# EAGLE design SparkFun_Ultrasonic_Sensor (EAGLE 9.6.2)
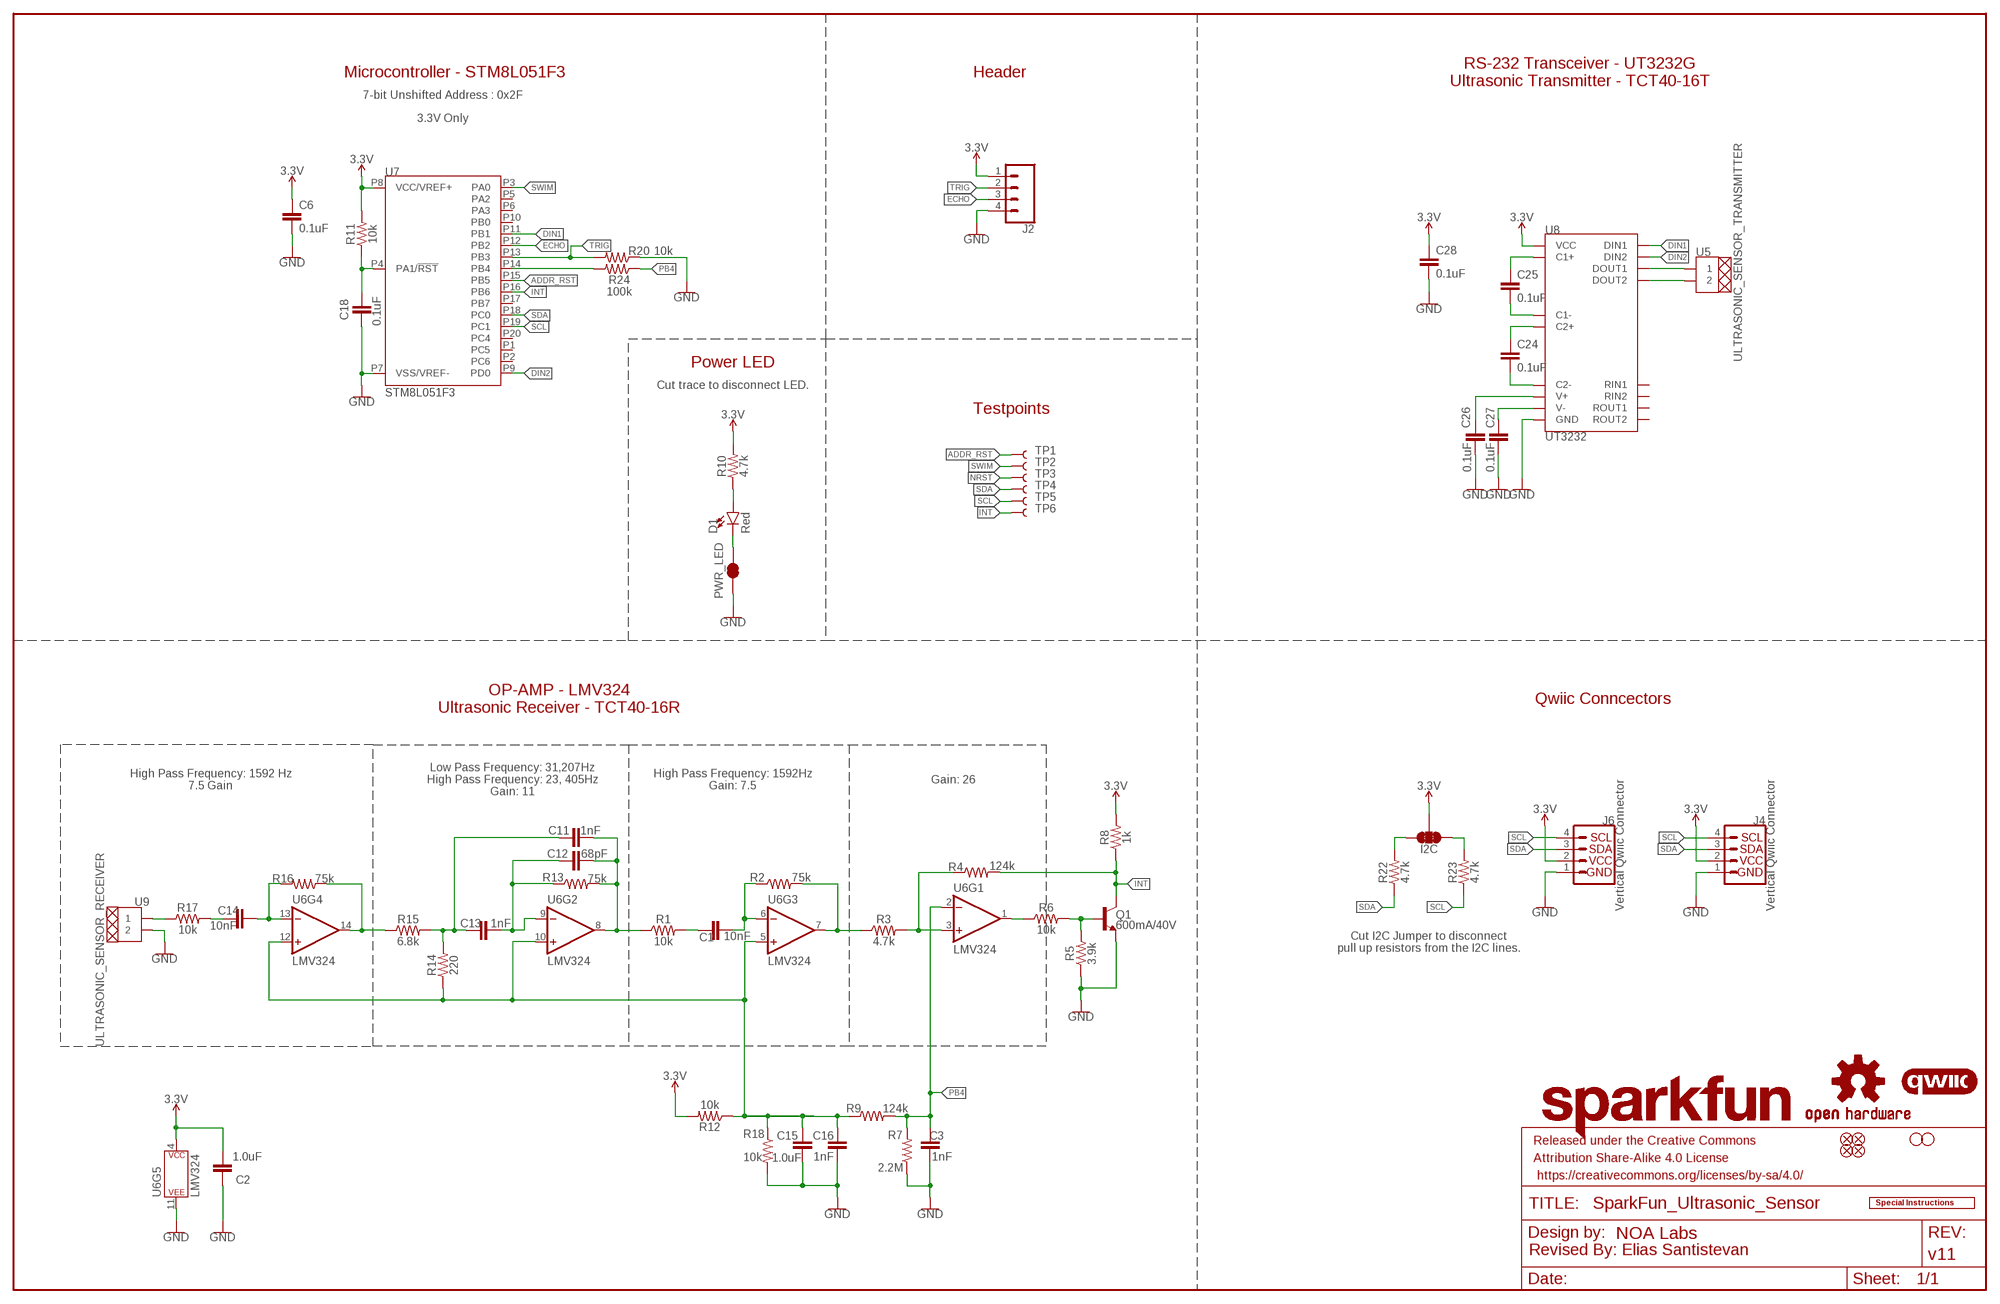
[diagram p0: schematic, sheet 1]

## Parts
C1  10nF  10NF-0603-50V-10%  [0603]
C2  1.0uF  1.0UF-0603-16V-10%  [0603]
C3  1nF  1.0NF/1000PF-0603-50V-10%  [0603]
C6  0.1uF  0.1UF-0603-25V-(+80/-20%)  [0603]
C11  1nF  1.0NF/1000PF-0603-50V-10%  [0603]
C12  68pF  68PF-0603-50V-5%  [0603]
C13  1nF  1.0NF/1000PF-0603-50V-10%  [0603]
C14  10nF  10NF-0603-50V-10%  [0603]
C15  1.0uF  1.0UF-0603-16V-10%  [0603]
C16  1nF  1.0NF/1000PF-0603-50V-10%  [0603]
C18  0.1uF  0.1UF-0603-25V-(+80/-20%)  [0603]
C24  0.1uF  0.1UF-0603-25V-(+80/-20%)  [0603]
C25  0.1uF  0.1UF-0603-25V-(+80/-20%)  [0603]
C26  0.1uF  0.1UF-0603-25V-(+80/-20%)  [0603]
C27  0.1uF  0.1UF-0603-25V-(+80/-20%)  [0603]
C28  0.1uF  0.1UF-0603-25V-(+80/-20%)  [0603]
D1  Red  LED-RED_0603-KB  [LED-0603]
FD1  FIDUCIAL1X2  [FIDUCIAL-1X2]
FD2  FIDUCIAL1X2  [FIDUCIAL-1X2]
FD3  FIDUCIAL1X2  [FIDUCIAL-1X2]
FD4  FIDUCIAL1X2  [FIDUCIAL-1X2]
FRAME1  FRAME-LEDGER  [CREATIVE_COMMONS]
H1  STAND-OFFTIGHT  [STAND-OFF-TIGHT]
H2  STAND-OFFTIGHT  [STAND-OFF-TIGHT]
I2C  JUMPER-SMT_3_2-NC_TRACE_SILK  [SMT-JUMPER_3_2-NC_TRACE_SILK]
J2  CONN_041X04_NO_SILK_NO_POP  [1X04_NO_SILK]
J4  Vertical Qwiic Connector  QWIIC_CONNECTOR  [JST04_1MM_VERT]
J6  Vertical Qwiic Connector  QWIIC_CONNECTOR  [JST04_1MM_VERT]
LOGO1  SPECIAL_INSTRUCTIONS-ORDERING  [ORDERING_INSTRUCTIONS]
LOGO2  SFE_LOGO_NAME.1_INCH  [SFE_LOGO_NAME_.1]
LOGO3  QWIIC_LOGO_3MM  [QWIIC_3MM]
LOGO4  OSHW-LOGOS  [OSHW-LOGO-S]
PWR_LED  JUMPER-SMT_2_NC_TRACE_SILK  [SMT-JUMPER_2_NC_TRACE_SILK]
Q1  600mA/40V  TRANS_NPN-MMBT2222AL  [SOT23-3]
R1  10k  10KOHM-0603-1/10W-1%  [0603]
R2  75k  75KOHM-0603-1/10W-1%  [0603]
R3  4.7k  4.7KOHM-0603-1/10W-1%  [0603]
R4  124k  124KOHM  [0603]
R5  3.9k  3.9KOHM-0603-1/10W-1%  [0603]
R6  10k  10KOHM-0603-1/10W-1%  [0603]
R7  2.2M  2.2MOHMS-0603-1/10W-1%  [0603]
R8  1k  1KOHM-0603-1/10W-1%  [0603]
R9  124k  124KOHM  [0603]
R10  4.7k  4.7KOHM-0603-1/10W-1%  [0603]
R11  10k  10KOHM-0603-1/10W-1%  [0603]
R12  10k  10KOHM-0603-1/10W-1%  [0603]
R13  75k  75KOHM-0603-1/10W-1%  [0603]
R14  220  220OHM-0603-1/10W-1%  [0603]
R15  6.8k  6.8KOHM-0603-1/10W-1%  [0603]
R16  75k  75KOHM-0603-1/10W-1%  [0603]
R17  10k  10KOHM-0603-1/10W-1%  [0603]
R18  10k  10KOHM-0603-1/10W-1%  [0603]
R20  10k  10KOHM-0603-1/10W-1%  [0603]
R22  4.7k  4.7KOHM-0603-1/10W-1%  [0603]
R23  4.7k  4.7KOHM-0603-1/10W-1%  [0603]
R24  100k  100KOHM-0603-1/10W-1%  [0603]
TP1  TEST-POINT3X5  [PAD.03X.05]
TP2  TEST-POINT3X5  [PAD.03X.05]
TP3  TEST-POINT3X5  [PAD.03X.05]
TP4  TEST-POINT3X5  [PAD.03X.05]
TP5  TEST-POINT3X5  [PAD.03X.05]
TP6  TEST-POINT3X5  [PAD.03X.05]
U5  ULTRASONIC_SENSOR_TRANSMITTER  [TFT40-16T]
U6  LMV324  [SO14]
U7  STM8L051F3  [TSSOP20]
U8  UT3232  [TSSOP16]
U9  ULTRASONIC_SENSOR_RECEIVER  [TCT40-16R]

## Nets
3.3V: C2.2 C6.1 C28.1 I2C.2 J2.1 J4.2 J6.2 R8.2 R10.2 R11.2 R12.2 U6.4(P$V+) U7.P8(VCC/VREF+) U8.P16(VCC)
ADDR_RST: TP1.1 U7.P15(PB5)
DIN1: U7.P11(PB1) U8.P11(DIN1)
DIN2: U7.P9(PD0) U8.P10(DIN2)
ECHO: J2.3 U7.P12(PB2)
GND: C2.1 C3.2 C6.2 C15.1 C16.1 C18.2 C26.2 C27.2 C28.2 J2.4 J4.1 J6.1 PWR_LED.1 Q1.2(E) R5.1 R7.1 R18.2 R20.1 U6.11(P$V-) U7.P7(VSS/VREF-) U8.P15(GND) U9.P2
INT: Q1.3(C) R4.2 R8.1 TP6.1 U7.P16(PB6)
N: R24.2 U7.P14(PB4)
N$1: R2.2 R3.1 U6.7(OUT)
N$2: C1.1 R2.1 U6.6(-IN)
N$3: C1.2 R1.2
N$4: R3.2 R4.1 U6.3(+IN)
N$5: Q1.1(B) R5.2 R6.2
N$6: R6.1 U6.1(OUT)
N$7: D1.A R10.1
N$8: C25.1 U8.P1(C1+)
N$9: C12.1 C13.1 R13.1 U6.9(-IN)
N$10: C11.2 C12.2 R1.1 R13.2 U6.8(OUT)
N$11: D1.C PWR_LED.2
N$12: C11.1 C13.2 R14.2 R15.2
N$14: R15.1 R16.1 U6.14(OUT)
N$15: C14.1 R16.2 U6.13(-IN)
N$16: C14.2 R17.2
N$19: I2C.3 R22.2
N$20: I2C.1 R23.2
N$26: R17.1 U9.P1
N$31: C15.2 C16.2 R9.1 R12.1 R14.1 R18.1 U6.5(+IN) U6.10(+IN) U6.12(+IN)
N$37: C25.2 U8.P3(C1-)
N$38: C24.1 U8.P4(C2+)
N$39: C24.2 U8.P5(C2-)
N$40: C27.1 U8.P6(V-)
N$41: C26.1 U8.P2(V+)
N$48: U5.P1 U8.P14(DOUT1)
N$49: U5.P2 U8.P7(DOUT2)
NRST: C18.1 R11.1 TP3.1 U7.P4(PA1/!RST!)
PB4: C3.1 R7.2 R9.2 R24.1 U6.2(-IN)
SCL: J4.4 J6.4 R23.1 TP5.1 U7.P19(PC1)
SDA: J4.3 J6.3 R22.1 TP4.1 U7.P18(PC0)
SWIM: TP2.1 U7.P3(PA0)
TRIG: J2.2 R20.2 U7.P13(PB3)
Unconnected: U7.P1(PC5) U7.P2(PC6) U7.P5(PA2) U7.P6(PA3) U7.P10(PB0) U7.P17(PB7) U7.P20(PC4) U8.P8(RIN2) U8.P9(ROUT2) U8.P12(ROUT1) U8.P13(RIN1)

## Notes on the sheet
- Microcontroller - STM8L051F3 | Header
- RS-232 Transceiver - UT3232G
  Ultrasonic Transmitter - TCT40-16T
- 7-bit Unshifted Address : 0x2F
- 3.3V Only
- Power LED
- Cut trace to disconnect LED.
- Testpoints
- OP-AMP - LMV324
  Ultrasonic Receiver - TCT40-16R
- Qwiic Conncectors
- High Pass Frequency: 1592 Hz
  7.5 Gain
- Low Pass Frequency: 31,207Hz
  High Pass Frequency: 23, 405Hz
  Gain: 11
- High Pass Frequency: 1592Hz
  Gain: 7.5
- Gain: 26
- Cut I2C Jumper to disconnect
  pull up resistors from the I2C lines.
- Revised By: Elias Santistevan

## Library data of the parts
C1 C14 = SparkFun-Capacitors:10NF: 0.01uF/10nF/10,000pF ceramic capacitors A capacitor is a passive two-terminal electrical component used to store electrical energy temporarily in an electric field. CAP-09321; PROD_ID: CAP-00867
C2 C15 = SparkFun-Capacitors:1.0UF: 1µF ceramic capacitors A capacitor is a passive two-terminal electrical component used to store electrical energy temporarily in an electric field.; PROD_ID: CAP-00868
C3 C11 C13 C16 = SparkFun-Capacitors:1.0NF/1000PF: 1nF/1,000pF ceramic capacitors A capacitor is a passive two-terminal electrical component used to store electrical energy temporarily in an electric field.; PROD_ID: CAP-07886
C6 C18 C24-C28 = SparkFun-Capacitors:0.1UF: 0.1µF ceramic capacitors A capacitor is a passive two-terminal electrical component used to store electrical energy temporarily in an electric field.; PROD_ID: CAP-00810
C12 = SparkFun-Capacitors:68PF: 68pF ceramic capacitors A capacitor is a passive two-terminal electrical component used to store electrical energy temporarily in an electric field.; PROD_ID: CAP-14092
D1 = SparkFun-LED:LED-RED: Red SMD LED Used in manufacturing of most products at SparkFun Packages: 0603 - KB - KingBright (DIO-17976) SMD 0603 package [Datasheet] <https://www.kingbrightusa.com/images/catalog/SPEC/APT1608SURCK.pdf> 0603 - (DIO-00819, has gone EOL) SMD 0603 package 0603 SMART - SMD 0603 SMART package ( more efficient and expensive)[Product Link] <http://www.osram-os.com/Graphics/XPic2/00077099_0.pdf> 1206 - SMD1206 package [Product Link] <https://www.sparkfun.com/datasheets/DevTools/LilyPad/Q150OVS4.pdff> SparkFun Products: Pro Mini 328 -5V <https://www.sparkfun.com/products/821> RedBoard <https://www.sparkfun.com/products/12757> IOIO-OTG <https://www.sparkfun.com/products/13613>; PROD_ID: DIO-17976
FD1-FD4 = SparkFun-Aesthetics:FIDUCIAL: Fiducial Alignment Points Point-of-reference for pick-and-place machines and other optical instruments.
FRAME1 = SparkFun-Aesthetics:FRAME-LEDGER: Schematic Frame - Ledger Standard 11x14 US Ledger frame; DESIGNER: NOA Labs; REV: v11
H1 H2 = SparkFun-Hardware:STAND-OFF: Stand Off Drill holes for mechanically mounting via screws, standoffs, etc. Note: Use the keepout ring to avoid running the screw head into surrounding components. Variant Overviews STAND-OFF - Mechanical footprint for a #4 phillips button head screw. STAND-OFF-TIGHT - Mechanical footprint for a #4 phillips button head screw, Example SparkFun Products Screw - Phillips Head (1/4", 4-40, 10 pack) <https://www.sparkfun.com/products/10453> (PRT-10453) Screw - Phillips Head (1/2", 4-40, 10 pack) <https://www.sparkfun.com/products/10452> (PRT-10452) Screw - Phillips Head (3/4", 4-40, 10 pack) <https://www.sparkfun.com/products/10451> (PRT-10451) Screw - Phillips Head (1", 4-40, 10 pack) <https://www.sparkfun.com/products/10450> (PRT-10450)
I2C = SparkFun-Jumpers:JUMPER-SMT_3_2-NC_TRACE: Normally closed trace jumper (2 of 2 connections) This jumper has a trace between all three pads so they are normally closed (NC). Use a razor knife to open the connection(s). For best results follow the IPC guidelines for cutting traces: Cutout at least 0.063 mm (0.005 in). Remove all loose material to clean up the cut area. Seal the cut with an approved epoxy. Reapply solder to reclose the connection(s).
J2 = SparkFun-Connectors:CONN_04: Multi connection point. Often used as Generic Header-pin footprint for 0.1 inch spaced/style header connections On any of the 0.1 inch spaced packages, you can populate with these: Break Away Headers - Straight <https://www.sparkfun.com/products/116> (PRT-00116) Break Away Male Headers - Right Angle <https://www.sparkfun.com/products/553> (PRT-00553) Female Headers <https://www.sparkfun.com/products/115> (PRT-00115) Break Away Headers - Machine Pin <https://www.sparkfun.com/products/117> (PRT-00117) Break Away Female Headers - Swiss Machine Pin <https://www.sparkfun.com/products/743> (PRT-00743) For SCREWTERMINALS and SPRING TERMINALS visit here: Screw Terimnals on SparkFun.com <https://www.sparkfun.com/search/results?term=Screw+Terminals> (5mm/3.5mm/2.54mm spacing) This device is also useful as a general connection point to wire up your design to another part of your project. Our various solder wires solder well into these plated through hole pads. Hook-Up Wire - Assortment (Stranded, 22 AWG) <https://www.sparkfun.com/products/11375> (PRT-11375) Hook-Up Wire - Assortment (Solid Core, 22 AWG) <https://www.sparkfun.com/products/11367> (PRT-11367) View the entire wire category on our website here <https://www.sparkfun.com/categories/141> Special notes: Molex polarized connector foot print use with SKU : PRT-08231 with associated crimp pins and housings. 1MM SMD Version SKU: PRT-10208
J4 J6 = SparkFun-Connectors:QWIIC_CONNECTOR: SparkFun I2C Standard Qwiic Connector An SMD 1mm pitch JST connector makes it easy and quick (get it? Qwiic?) to connect I2C devices to each other. The Qwiic system <http://www.sparkfun.com/qwiic> enables fast and solderless connection between popular platforms and various sensors and actuators. We carry 200mm <https://www.sparkfun.com/products/14204>, 100mm <https://www.sparkfun.com/products/14205>, 50mm <https://www.sparkfun.com/products/14206>, and breadboard friendly <https://www.sparkfun.com/products/14207> Qwiic cables. We also offer 10 pcs strips <https://www.sparkfun.com/products/14323> the SMD connectors.; PROD_ID: CONN-14483
LOGO1 = SparkFun-Aesthetics:SPECIAL_INSTRUCTIONS: Special Ordering/Production Instructions Alert Symbol for special PCB ordering instructions or unique production process warnings. Ordering Instructions Production Instructions Types of information that should be added to box: Copper weight Soldermask color Silk color PCB thickness Number of layers PCB Standard: 1.6mm FR4 1 oz copper immersion silver plating red soldermask white silkscreen Types of information that should be added to box: Special wash requirements Depaneling instructions Humidification Glue curing Default text settings: 0.07 inch 9% ratio 50% line distance
LOGO2 = SparkFun-Aesthetics:SFE_LOGO_NAME: SparkFun Font Logo This is the SparkFun name logo. The logo on the schematic will always be the same size; the package variant is the height of the flame part of the logo (or the height the flame would be, if it were drawn). Default layer for the logo on the board is tSilk.
LOGO3 = SparkFun-Aesthetics:QWIIC_LOGO: Qwiic Logos for placement on schematic and PCB. The 5.5mm silk logo is best for placing next to Qwiic connector.
LOGO4 = SparkFun-Aesthetics:OSHW-LOGO: Open-Source Hardware (OSHW) Logo This logo indicates the piece of hardware it is found on incorporates a OSHW license and/or adheres to the definition of open source hardware found here: http://freedomdefined.org/OSHW
PWR_LED = SparkFun-Jumpers:JUMPER-SMT_2_NC_TRACE: Normally closed trace jumper This jumper has a trace between two pads so it's normally closed (NC). Use a razor knife to open the connection. For best results follow the IPC guidelines for cutting traces: Cutout at least 0.063 mm (0.005 in). Remove all loose material to clean up the cut area. Seal the cut with an approved epoxy. Reapply solder to reclose the connection.
Q1 = SparkFun-DiscreteSemi:TRANS_NPN: NPN transistor Current controlled devices typically used to amplify current or used as a switch. BC547 - COM-08928 <http://www.sparkfun.com/products/8928> (TO-92 45V 100mA) (1.Collector 2.Base 3.Emitter) 2N3904 - COM-00521 <http://www.sparkfun.com/products/521> (TO-92 40V 200mA) (1.Emitter 2.Base 3.Collector) P2N2222A - COM-12852 <http://www.sparkfun.com/products/12852> (TO-92 40V 600mA) (1.Collector 2.Base 3.Emitter); PROD_ID: TRANS-08049
R1 R6 R11 R12 R17 R18 R20 = SparkFun-Resistors:10KOHM: 10kΩ resistor A resistor is a passive two-terminal electrical component that implements electrical resistance as a circuit element. Resistors act to reduce current flow, and, at the same time, act to lower voltage levels within circuits. - Wikipedia; PROD_ID: RES-00824
R2 R13 R16 = SparkFun-Resistors:75KOHM: 75kΩ resistor A resistor is a passive two-terminal electrical component that implements electrical resistance as a circuit element. Resistors act to reduce current flow, and, at the same time, act to lower voltage levels within circuits. - Wikipedia; PROD_ID: RES-09737
R3 R10 R22 R23 = SparkFun-Resistors:4.7KOHM: 4.7kΩ resistor A resistor is a passive two-terminal electrical component that implements electrical resistance as a circuit element. Resistors act to reduce current flow, and, at the same time, act to lower voltage levels within circuits. - Wikipedia; PROD_ID: RES-07857
R4 R9 = SparkFun-Resistors:124KOHM: 124kΩ resistor A resistor is a passive two-terminal electrical component that implements electrical resistance as a circuit element. Resistors act to reduce current flow, and, at the same time, act to lower voltage levels within circuits. - Wikipedia; PROD_ID: RES-14395
R5 = SparkFun-Resistors:3.9KOHM: 3.9kΩ resistor A resistor is a passive two-terminal electrical component that implements electrical resistance as a circuit element. Resistors act to reduce current flow, and, at the same time, act to lower voltage levels within circuits. - Wikipedia; PROD_ID: RES-08701
R7 = SparkFun-Resistors:2.2MOHMS: 2MΩ resistor A resistor is a passive two-terminal electrical component that implements electrical resistance as a circuit element. Resistors act to reduce current flow, and, at the same time, act to lower voltage levels within circuits. - Wikipedia; PROD_ID: RES-10054
R8 = SparkFun-Resistors:1KOHM: 1kΩ resistor A resistor is a passive two-terminal electrical component that implements electrical resistance as a circuit element. Resistors act to reduce current flow, and, at the same time, act to lower voltage levels within circuits. - Wikipedia; PROD_ID: RES-07856
R14 = SparkFun-Resistors:220OHM: 220Ω resistor A resistor is a passive two-terminal electrical component that implements electrical resistance as a circuit element. Resistors act to reduce current flow, and, at the same time, act to lower voltage levels within circuits. - Wikipedia; PROD_ID: RES-07861
R15 = SparkFun-Resistors:6.8KOHM: 6.8kΩ resistor A resistor is a passive two-terminal electrical component that implements electrical resistance as a circuit element. Resistors act to reduce current flow, and, at the same time, act to lower voltage levels within circuits. - Wikipedia; PROD_ID: RES-08597
R24 = SparkFun-Resistors:100KOHM: 100kΩ resistor A resistor is a passive two-terminal electrical component that implements electrical resistance as a circuit element. Resistors act to reduce current flow, and, at the same time, act to lower voltage levels within circuits. - Wikipedia; PROD_ID: RES-07828
TP1-TP6 = SparkFun-Connectors:TEST-POINT: SparkFun Test Points Bare copper test points for troubleshooting or In-Circuit-Testing. These are used by our Production team for verifying production board runs using pogo-pins on test beds. SparkFun Products: SparkFun LSM9DS1 Breakout <https://www.sparkfun.com/products/13284> SparkFun PSOC <https://www.sparkfun.com/products/13714> SparkFun Load Cell Amplifier <https://www.sparkfun.com/products/13879>
U5 = new_parts:ULTRASONIC_SENSOR: CU Devices - CUSA-R/T80 Ultrasonic Receivers and Transmitters; PROD_ID: SEN-21316
U6 = SparkFun-IC-Amplifiers:LMV324: IC LMV324 Quad Op Amp Jellybean quad op-amp Datasheet <http://cdn.sparkfun.com/datasheets/Sensors/Sound/LMV324.pdf> SparkFun Products SparkFun Sensor Kit <https://www.sparkfun.com/products/13754> (DEV-13754) SparkFun Inventor's Kit for Arduino 101 <https://www.sparkfun.com/products/13844> (KIT-13844) SparkFun Sound Detector <https://www.sparkfun.com/products/12642> (SEN-12642); PROD_ID: IC-08227
U7 = new_parts:STM8L051F3: ST STM8L051F3 Low-Power MCU STM8L051F3 features an enhanced STM8 CPU core providing increased processing power (up to 16 MIPS at 16 MHz) while maintaining the advantages of a CISC architecture with improved code density, a 24-bit linear addressing space and an optimized architecture for low-power operations. The STM8L051F3 MCU includes an integrated debug module with a hardware interface (SWIM) which allows non-intrusive In-Application debugging and ultra-fast Flash programming. It features an embedded data EEPROM and low-power, low-voltage, singlesupply program Flash memory. The device incorporates an extensive range of enhanced I/Os and peripherals, a 12-bit ADC, a real-time clock, two 16-bit timers, one 8-bit timer, as well as standard communication interfaces such as an SPI, an I2C interface, and one USART. The modular design of the peripheral set allows this device to have the same peripherals that can be found in different ST microcontroller families including 32-bit families. This makes any transition to a different family very easy, supported also by the use of a common set of development tools.; PROD_ID: IC-21318
U8 = new_parts:UT3232: Unisonic Technologies - UT3232 TThe UTC UT3232 has two receivers and two drivers, and a dual charge-pump circuit. The device meets the requirements of TIA/EIA-232-F and provides the electrical interface between an asynchronous communication controller and the serial-port connector. The charge pump and four small external capacitors allow operation from a single 3.0V to 5.5V supply. The device operates at data signaling rates up to 250kbit/s and a maximum of 35V/μs driver output slew rate.; PROD_ID: IC-21317
U9 = new_parts:ULTRASONIC_SENSOR: CU Devices - CUSA-R/T80 Ultrasonic Receivers and Transmitters; PROD_ID: SEN-21315

## Board
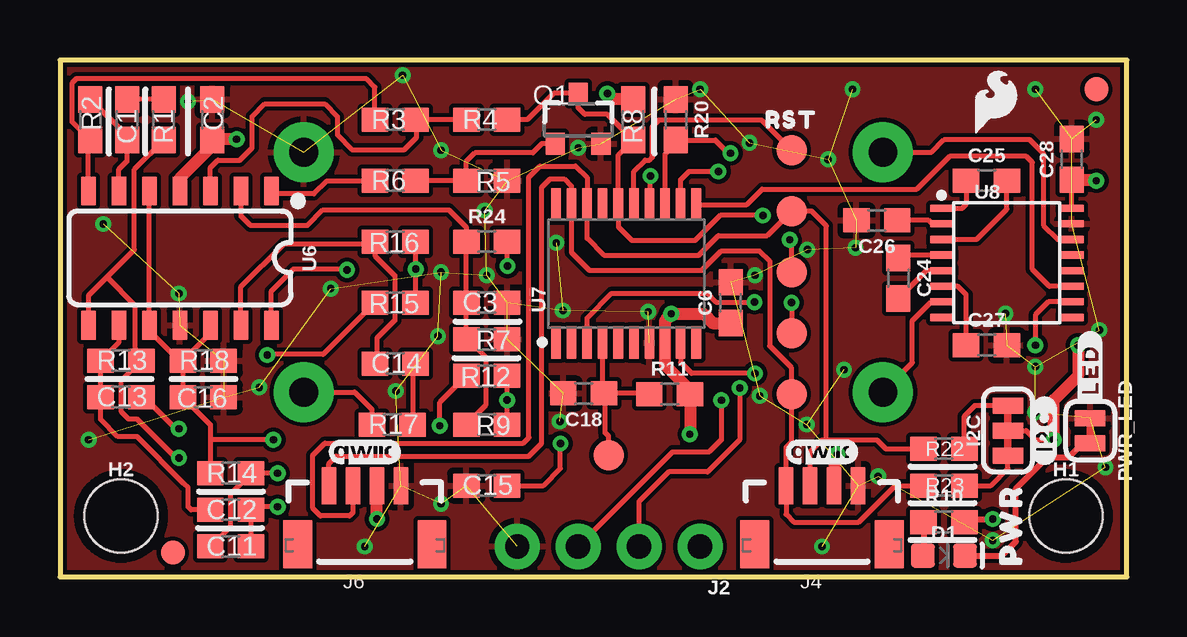
[diagram p1: board, top side]
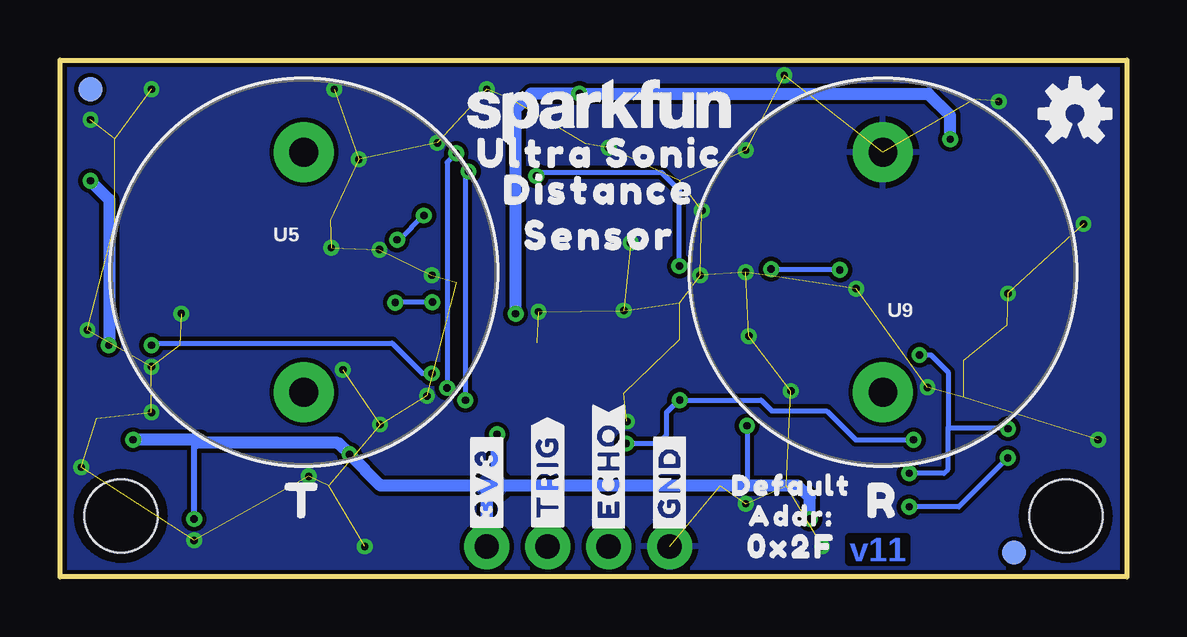
[diagram p2: board, bottom side, seen from below]

Size 44.45 x 21.54 mm. Coordinates in mm from the lower left corner, seen from the top.
Outline: 0,0 44.45,0 44.45,21.54 0,21.54 0,0
Copper layers (1+16): Top 0.035559375mm / dielectric 0.47751875mm / Bottom 0.035559375mm
Design rules "SparkFun-4-Layer-General-JLCPCB *": minimum track width 7mil, minimum drill 12mil, track to track 7mil, track to pad 7mil, pad to pad 7mil, via to via 7mil, smd to smd 7mil, copper to edge 7mil, drill to drill 7mil, minimum pad ring 7mil, minimum via ring 7mil, stop-mask expansion 3mil, vias tented up to drill 25mil, thermal gap 10mil

### Footprints (pad centres in the part's own frame; a part is rotated, then mirrored left to right if it is on the bottom)
0603 = smd 1.1 x 1: 1 -0.85,0; 2 0.85,0
LED-0603 = smd 1 x 1: A -0.877,0; C 0.877,0
FIDUCIAL-1X2 = smd 1 x 1: 1 0,0
STAND-OFF-TIGHT = hole 3.048: 0,0
SMT-JUMPER_3_2-NC_TRACE_SILK = smd 0.66 x 1.27: 1 -1.041,0; 2 0,0; 3 1.041,0
1X04_NO_SILK = drill 1.016 pad 1.88: 1 0,0; 2 2.54,0; 3 5.08,0; 4 7.62,0
JST04_1MM_VERT = smd 0.6 x 1.55: 1 -1.5,0.775; 2 -0.5,0.775; 3 0.5,0.775; 4 1.5,0.775 | smd 1.2 x 2: NC1 -2.8,3.2; NC2 2.8,3.2
SMT-JUMPER_2_NC_TRACE_SILK = smd 0.66 x 1.27: 1 -0.521,0; 2 0.521,0
SOT23-3 = smd 0.8 x 0.9: 1 -0.95,-1; 2 0.95,-1; 3 0,1.1
PAD.03X.05 = smd 1.27 x 1.27: 1 0,0
TFT40-16T = drill 1.2 pad 2.5: P1 0,5; P2 0,-5
SO14 = smd 0.6 x 1.2: 1 -3.175,-2.8; 2 -1.905,-2.8; 3 -0.635,-2.8; 4 0.635,-2.8; 5 1.905,-2.8; 6 3.175,-2.8; 7 4.445,-2.8; 8 4.445,2.8; 9 3.175,2.8; 10 1.905,2.8; 11 0.635,2.8; 12 -0.635,2.8; 13 -1.905,2.8; 14 -3.175,2.8
TSSOP20 = smd 1.35 x 0.4: P1 -2.911,2.878; P2 -2.911,2.228; P3 -2.911,1.578; P4 -2.911,0.928; P5 -2.911,0.278; P6 -2.911,-0.372; P7 -2.911,-1.022; P8 -2.911,-1.672; P9 -2.911,-2.322; P10 -2.911,-2.972; P11 2.839,-2.972; P12 2.839,-2.322; P13 2.839,-1.672; P14 2.839,-1.022; P15 2.839,-0.372; P16 2.839,0.278; P17 2.839,0.928; P18 2.839,1.578; P19 2.839,2.228; P20 2.839,2.878
TSSOP16 = smd 1 x 0.3: P1 -2.607,2.153; P2 -2.607,1.503; P3 -2.607,0.853; P4 -2.607,0.203; P5 -2.607,-0.447; P6 -2.607,-1.097; P7 -2.607,-1.747; P8 -2.607,-2.397; P9 2.793,-2.397; P10 2.793,-1.747; P11 2.793,-1.097; P12 2.793,-0.447; P13 2.793,0.203; P14 2.793,0.853; P15 2.793,1.503; P16 2.793,2.153
TCT40-16R = drill 1.2 pad 2.5: P1 0,5; P2 0,-5

### Placement (x,y rotation side)
C1  2.79,19.05 90 top
C2  6.35,19.05 270 top
C3  17.78,11.43 0 top
C6  27.94,11.43 90 top
C11  7.11,1.27 0 top
C12  7.11,2.79 0 top
C13  2.54,7.49 0 top
C14  13.97,8.89 0 top
C15  17.78,3.81 0 top
C16  5.97,7.49 180 top
C18  21.82,7.65 180 top
C24  34.92,12.45 270 top
C25  38.61,16.51 0 top
C26  34.04,14.86 180 top
C27  38.61,9.65 0 top
C28  42.16,17.4 90 top
D1  36.83,0.89 0 top
FD1  4.7,1.02 90 top
FD2  43.18,20.32 90 top
FD3  43.18,20.32 90 bottom
FD4  4.7,1.02 90 bottom
FRAME1  77.93,-8.87 0 top  (outside the outline)
H1  41.91,2.54 0 top
H2  2.54,2.54 0 top
I2C  39.5,6.1 90 top
J2  26.67,1.27 180 top
J4  31.75,4.57 180 top
J6  12.7,4.57 180 top
LOGO1  57.15,50.8 0 top  (outside the outline)
LOGO2  21.97,19.3 0 bottom
LOGO3  12.7,5.21 0 top
LOGO4  2.16,19.3 0 bottom
PWR_LED  42.93,6.1 270 top
Q1  21.59,19.05 0 top
R1  4.32,19.05 90 top
R2  1.27,19.05 270 top
R3  13.97,19.05 0 top
R4  17.78,19.05 0 top
R5  17.78,16.51 180 top
R6  13.97,16.51 0 top
R7  17.78,9.91 180 top
R8  23.88,19.05 90 top
R9  17.78,6.35 180 top
R10  36.83,2.29 0 top
R11  25.4,7.62 0 top
R12  17.78,8.38 180 top
R13  2.54,9.02 0 top
R14  7.11,4.32 0 top
R15  13.97,11.43 180 top
R16  13.97,13.97 180 top
R17  13.84,6.35 0 top
R18  5.97,9.02 0 top
R20  25.65,19.05 270 top
R22  36.83,5.33 0 top
R23  36.83,3.81 0 top
R24  17.78,13.97 0 top
TP1  30.48,17.78 0 top
TP2  30.48,10.16 0 top
TP3  22.86,5.08 0 top
TP4  30.48,15.24 0 top
TP5  30.48,7.62 0 top
TP6  30.48,12.7 0 top
U5  34.29,12.7 0 bottom
U6  5.63,13.29 180 top
U7  23.54,12.68 90 top
U8  39.37,13.21 0 top
U9  10.16,12.7 180 bottom
U$1  [#ECHO#0]  21.59,4.45 90 bottom
U$2  [#TRIG#1]  24.13,4.19 90 bottom
U$3  [#GND#4]  19.05,3.94 90 bottom
U$4  [#3V3#2]  26.67,3.94 90 bottom
U$5  [QWIIC_3MM]  31.75,5.21 0 top
U$6  [SFE_LOGO_FLAME_.1]  38.99,19.81 0 top
U$7  [#I2C#16]  41.02,6.1 90 top
U$8  [T103]  34.29,3.17 0 bottom
U$9  [R104]  10.16,3.17 0 bottom
U$10  [DISTANCE101]  21.97,16.13 0 bottom
U$11  [ULTRA_SONIC100]  21.97,17.65 0 bottom
U$12  [SENSOR102]  21.97,14.22 0 bottom
U$13  [DEFAULT129]  13.97,3.81 0 bottom
U$14  [ADDR#130]  13.97,2.54 0 bottom
U$15  [0X2F131]  13.97,1.27 0 bottom
U$16  [PWR17]  39.62,2.16 90 top
U$17  [#LED#15]  42.93,8.64 90 top
U$18  [RST132]  30.48,19.05 0 top

### Tracks (layer width: path | path; a pad name or v marks a point on that pad's centre or on a via)
3.3V  (via drill 0.3)
  Top 0.203: U8.P16 C28.1 | I2C.2 40.26,6.1 40.64,5.71 v41.4,5.71 | R12.2 15.82,7.28 v15.82,6.3
  Top 0.254: R10.2 37.81,2.41 v38.86,2.41
  Top 0.508: v42.42,9.65 42.42,8.38 41.4,7.37 v41.4,5.71 | R8.2 23.05,19.9 v22.81,20.14 | v26.24,5.94 26.25,5.96 R11.2 26.25,7.79 25.21,8.82 U7.P8 25.21,10.67 25.27,10.73 25.27,10.77 v25.47,10.96 26.81,10.96 27.2,10.58 C6.1 | U6.4 5,16.6 6.35,17.96 C2.2 6.39,18.24 v7.36,18.24 | v32.38,5.11 32.25,4.97 J4.2 | C28.1 43.14,16.55 v43.18,16.51 | v13.21,2.41 13.2,2.42 J6.2
  Bottom 0.203: v15.82,6.3 15.82,3.89 15.75,3.81
  Bottom 0.254: v38.86,2.41 38.86,5.46 38.73,5.59 38.61,5.71
  Bottom 0.508: v42.42,9.65 42.39,9.68 42.39,15.72 v43.18,16.51 | v25.47,10.96 25.47,19.49 24.82,20.14 v22.81,20.14 8.27,20.14 7.36,19.23 v7.36,18.24 | 38.73,5.59 32.87,5.59 v32.38,5.11 31.09,3.81 26.67,3.81 J2.1 26.67,3.4 26.26,3.81 | 38.61,5.71 v41.4,5.71 | 26.26,3.81 15.75,3.81 13.72,3.81 13.21,3.3 v13.21,2.41 | v26.24,5.94 26.26,5.92 26.26,3.81
  pour Bottom (isolate 0.305, no thermals): 26.44,4.35 25.93,3.79 26.51,3.29 26.98,3.77
ADDR_RST
  Top 0.203: U7.P15 23.91,16.9 24.38,17.37 24.57,17.37 24.68,17.48 24.68,18.76 24.95,19.03 29.23,19.03 TP1.1
DIN1
  Top 0.203: U8.P11 41.23,12.11 40.51,12.83 40.51,17.27 40.26,17.53 37.08,17.53 35.7,16.15 29.26,16.15 28.62,15.52 U7.P11
DIN2  (via drill 0.3)
  Top 0.203: U8.P10 41.18,11.46 40.64,10.92 v40.64,9.65 | U7.P9 25.86,8.94 26.31,8.48 28.95,8.48 v28.96,8.47
  Bottom 0.203: v28.96,8.47 29.34,8.47 30.61,9.74 40.55,9.74 v40.64,9.65
ECHO  (via drill 0.3)
  Top 0.203: v27.43,16.89 26.2,16.89 25.86,16.55 U7.P12 | J2.3 25.53,5.21 27.05,5.21 27.56,5.71 v27.56,7.36
  Bottom 0.203: v27.43,16.89 27.56,16.76 v27.56,7.36
GND  (via drill 0.3)  (61 unrouted)
  other vias: 33.15,13.72 24.51,11.05 15.88,3.05 34.09,4.19 5.33,19.81 17.78,12.57 20.83,6.48 8.31,7.9 4.95,11.81 26.67,20.32 21.59,17.88 29.16,7.54 17.7,15.27 40.64,8.76 15.75,10.03 15.88,12.7 28.96,12.57 11.28,12.01 14,7.75 15.88,17.78 20.95,11.1 20.68,13.92 32,17.4 39.4,10.97 1.8,14.71 12.7,1.27 31.75,1.27 38.86,1.52 43.31,10.29 43.18,19.05 40.64,20.32 33.02,20.32 14.27,20.9 32.66,8.64 1.19,5.71 31.14,13.64 31.11,6.35 28.73,18.08 43.56,4.57 40.64,6.86
  pour Top (rank 3): 0,21.54 44.45,21.54 44.45,0 0,0
  pour Bottom (rank 4): 0,21.54 44.45,21.54 44.45,0 0,0
INT  (via drill 0.3)
  Top 0.203: R4.2 19.47,19.05 20.57,20.15 Q1.3 21.59,19.56 21.87,19.28 22.8,19.28 R8.1 23.26,17.59 U7.P16 23.26,14.58 23.82,14.02 26.47,14.02 27.53,15.09 29.26,15.09 v29.29,15.06 | TP6.1 30.48,13.97 v30.4,14.05
  Bottom 0.203: v30.4,14.05 30.3,14.05 v29.29,15.06
N  (via drill 0.3)
  Top 0.203: U7.P14 24.6,15.56 v24.6,16.7 | R24.2 18.63,12.97 v18.64,12.95
  Bottom 0.203: v18.64,12.95 18.64,16.1 19.4,16.86 24.45,16.86 v24.6,16.7
N$1
  Top 0.203: U6.7 1.19,18.11 R2.2 0.49,18.98 0.49,20.57 0.68,20.75 12.78,20.75 13.12,20.41 R3.1
N$2
  Top 0.203: U6.6 2.46,17 2.79,17.34 C1.1 2.79,18.38 R2.1
N$3
  Top 0.203: R1.2 C1.2
N$4
  Top 0.203: R4.1 R3.2 14.86,19.01 14.86,18.31 14.35,17.8 12.17,17.8 11.56,18.41 11.56,19.18 11.03,19.71 8.53,19.71 8,19.18 8,17.88 7.49,17.37 6.58,17.37 6.26,17.06 U6.3
N$5
  Top 0.203: R6.2 R5.2 16.93,17.31 17.29,17.67 19.7,17.67 20.08,18.05 Q1.1
N$6
  Top 0.203: U6.1 8.8,15.96 10.58,15.96 11.12,16.5 13.11,16.5 R6.1
N$7
  Top 0.254: R10.1 35.98,0.92 D1.A
N$8
  Top 0.203: U8.P1 37.59,15.36 37.76,15.53 C25.1
N$9
  Top 0.203: U6.9 2.46,9.78 R13.1 C13.1 1.69,6.57 2.41,5.84 3.21,5.84 5.16,3.89 5.33,3.72 5.33,2.92 5.46,2.79 C12.1
N$10  (via drill 0.3)
  Top 0.203: 1.97,12.51 3.1,13.64 3.1,16.98 R1.1 | 1.97,12.51 1.19,11.73 U6.8 | C11.2 C12.2 8.09,2.92 v9.07,2.92 | v4.96,4.96 4.82,4.96 3.19,6.59 2.85,6.59 2.56,6.88 2.56,8.2 3.38,9.02 R13.2 3.39,9.27 3.15,9.52 3.15,11.31 1.97,12.48 1.97,12.51
  Bottom 0.203: v4.96,4.96 7,2.92 v9.07,2.92
N$11
  Top 0.254: PWR_LED.2 42.62,5.58 42.02,4.98 41.14,4.98 39.83,3.67 39.83,1.47 39.24,0.89 D1.C
N$12  (via drill 0.3)
  Top 0.203: R15.2 10.96,9.27 8.89,9.27 8.87,9.25 v8.64,9.25 | C11.1 7.11,2.12 7.11,3.47 R14.2 v9.07,4.32 | C13.2 3.51,7.49 4.83,6.18 v4.95,6.18
  Bottom 0.203: v8.64,9.25 8.16,9.25 7.44,8.53 7.44,6.22 | v9.07,4.32 7.62,4.32 7.44,4.5 7.44,6.22 | 7.44,6.22 5,6.22 v4.95,6.18
N$14  (via drill 0.3)
  Top 0.203: U6.14 8.8,11.9 9.72,12.82 11.93,12.82 v11.96,12.79 | R15.1 v14.82,12.83 R16.1
  Bottom 0.203: v14.82,12.83 11.99,12.83 v11.96,12.79
N$15
  Top 0.203: C14.1 13.21,8.98 13.21,9.95 13.95,10.69 13.95,12.55 13.12,13.38 R16.2 13.02,13.87 9.32,13.87 7.54,12.08 U6.13
N$16
  Top 0.203: C14.2 14.69,8.76 R17.2
N$19
  Top 0.203: R22.2 37.68,6.71 38.11,7.14 I2C.3
N$20
  Top 0.203: R23.2 38.79,3.81 39.5,4.52 I2C.1
N$26
  Top 0.203: R17.1 12.99,6.99 12.28,7.7 U9.P1
N$31  (via drill 0.3)
  Top 0.203: R18.1 C16.2 6.26,6.35 6.26,5.71 | U6.12 6.26,10.16 R18.1 | U6.5 U6.10 3.73,10.25 4.96,9.02 R18.1 | C15.2 20.14,3.81 20.85,4.52 v20.85,5.56 | R12.1 v18.63,7.37 R9.1 | 6.26,5.71 R14.1 | v8.89,5.71 6.26,5.71
  Bottom 0.203: v20.85,5.56 19.53,5.56 19.18,5.92 19.18,6.86 18.67,7.37 v18.63,7.37 15.24,7.37 14.8,6.92 12.51,6.92 11.3,5.71 v8.89,5.71
N$37
  Top 0.203: C25.2 39.46,15.33 38.19,14.06 U8.P3
N$38
  Top 0.203: U8.P4 35.04,13.41 C24.1
N$39
  Top 0.203: U8.P5 36.09,12.76 C24.2
N$40
  Top 0.203: C27.1 37.76,11.77 37.41,12.11 U8.P6
N$41
  Top 0.203: U8.P2 36.34,14.71 36.2,14.86 C26.1
N$48
  Top 0.203: U8.P14 41.56,14.06 40.97,14.66 40.97,17.65 40.41,18.21 36.83,18.21 36.32,17.7 U5.P1
N$49
  Top 0.203: U8.P7 36.3,11.46 35.52,10.68 35.52,8.93 U5.P2
NRST
  Top 0.203: 22.65,7.63 C18.1 24.52,7.64 R11.1 | U7.P4 22.61,7.67 22.65,7.63 | TP3.1 22.86,5.87 22.71,6.02 22.71,7.57 22.65,7.63
PB4
  Top 0.203: U6.2 7.54,15.04 7.93,14.65 10.31,14.65 10.96,15.29 16.2,15.29 16.93,14.57 R24.1 C3.1 R7.2 16.98,9.91 17.76,9.12 17.76,7.18 R9.2
SCL
  Top 0.203: R23.1 34.8,3.81 33.27,2.29 30.57,2.29 30.25,2.61 J4.4 30.25,5.4 30.48,5.63 TP5.1 30.48,8.71 29.57,9.63 29.57,13.17 29.14,13.59 27.56,13.59 26.75,12.78 22.06,12.78 21.31,13.53 U7.P19 21.31,16.28 21.01,16.59 20.42,16.59 20.07,16.23 20.07,5.56 19.53,5.03 11.51,5.03 11.2,4.72 J6.4
SDA
  Top 0.203: 31.93,5.71 31.93,14.63 31.32,15.24 TP4.1 29.46,14.22 27.43,14.22 26.62,13.41 22.66,13.41 21.96,14.11 U7.P18 21.96,16.65 21.49,17.12 19.99,17.12 19.53,16.66 19.53,5.81 19.3,5.57 11.03,5.57 10.54,5.08 10.54,2.85 10.85,2.54 12.06,2.54 12.2,2.67 J6.3 | J4.3 31.25,5.21 31.75,5.71 31.93,5.71 | 31.93,5.71 34.03,5.71 34.42,5.33 R22.1
SWIM  (via drill 0.3)
  Top 0.203: U7.P3 21.96,10.79 22.99,11.81 26.96,11.81 27.32,11.45 v28.93,11.45 | v30.48,11.43 TP2.1
  Bottom 0.203: v28.93,11.45 30.46,11.45 v30.48,11.43
TRIG  (via drill 0.3)
  Top 0.203: U7.P13 25.21,17.63 25.65,18.07 R20.2 27.3,18.2 27.85,17.65 v27.94,17.65 | J2.2 24.13,3.15 25.36,4.38 26.99,4.38 28.32,5.71 v28.32,7.87
  Bottom 0.203: v27.94,17.65 28.32,17.27 v28.32,7.87

### Text on the board
Bottom: v11
Measures: Units In Inches
tDocu: Two Layer / 1.6mm Thickness / 1 oz. Copper / Red Soldermask / White Silkscreen / HASL Lead Free / Material: TG135-140 | NOA Labs | Revised By: Elias Santistevan